# EAGLE design backplane-rev2 (EAGLE 9.6.2)
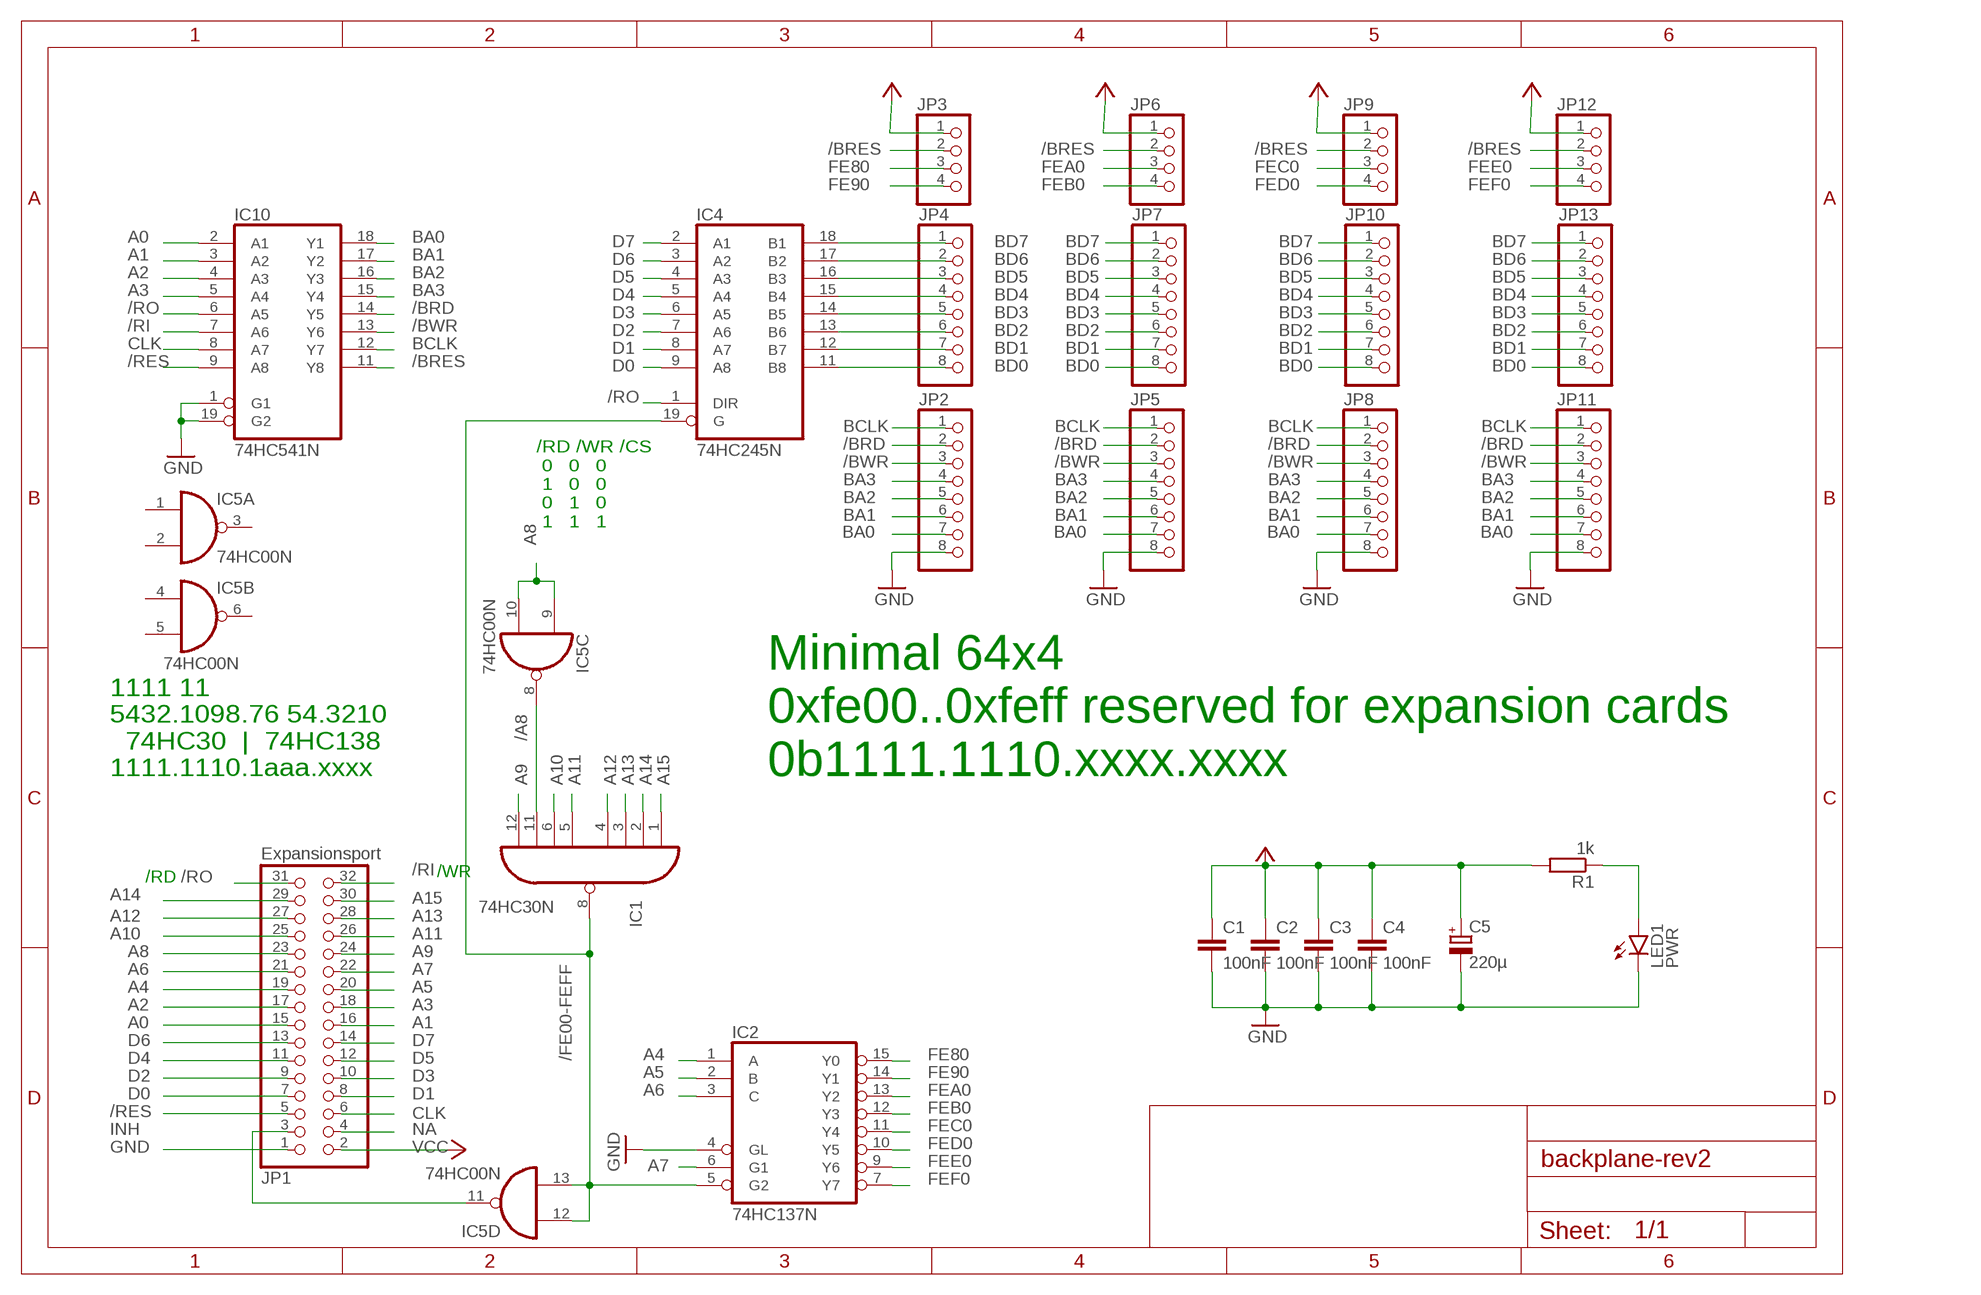
[diagram p0: schematic, sheet 1]

## Parts
C1  100nF  C-EU050-025X075  [C050-025X075]
C2  100nF  C-EU050-025X075  [C050-025X075]
C3  100nF  C-EU050-025X075  [C050-025X075]
C4  100nF  C-EU050-025X075  [C050-025X075]
C5  220µ  CPOL-EUE3.5-8  [E3,5-8]
IC1  74HC30N  [DIL14]
IC2  74HC137N  [DIL16]
IC4  74HC245N  [DIL20]
IC5  74HC00N  [DIL14]
IC10  74HC541N  [DIL20]
JP1  Expansionsport  PINHD-2X16  [2X16]
JP2  PINHD-1X8  [1X08]
JP3  PINHD-1X4  [1X04]
JP4  PINHD-1X8  [1X08]
JP5  PINHD-1X8  [1X08]
JP6  PINHD-1X4  [1X04]
JP7  PINHD-1X8  [1X08]
JP8  PINHD-1X8  [1X08]
JP9  PINHD-1X4  [1X04]
JP10  PINHD-1X8  [1X08]
JP11  PINHD-1X8  [1X08]
JP12  PINHD-1X4  [1X04]
JP13  PINHD-1X8  [1X08]
LED1  PWR  LED3MM  [LED3MM]
R1  1k  R-EU_0207/10  [0207/10]

## Nets
/A8: IC1.11(I6) IC5.8(C:O)
/BRD: IC10.14(Y5) JP2.2 JP5.2 JP8.2 JP11.2
/BRES: IC10.11(Y8) JP3.2 JP6.2 JP9.2 JP12.2
/BWR: IC10.13(Y6) JP2.3 JP5.3 JP8.3 JP11.3
/FE00-FEFF: IC1.8(O) IC2.5(G2) IC4.19(G) IC5.12(D:I0) IC5.13(D:I1)
/RES: IC10.9(A8) JP1.5
/RI: IC10.7(A6) JP1.32
/RO: IC4.1(DIR) IC10.6(A5) JP1.31
A0: IC10.2(A1) JP1.15
A1: IC10.3(A2) JP1.16
A2: IC10.4(A3) JP1.17
A3: IC10.5(A4) JP1.18
A4: IC2.1(A) JP1.19
A5: IC2.2(B) JP1.20
A6: IC2.3(C) JP1.21
A7: IC2.6(G1) JP1.22
A8: IC5.9(C:I0) IC5.10(C:I1) JP1.23
A9: IC1.12(I7) JP1.24
A10: IC1.6(I5) JP1.25
A11: IC1.5(I4) JP1.26
A12: IC1.4(I3) JP1.27
A13: IC1.3(I2) JP1.28
A14: IC1.2(I1) JP1.29
A15: IC1.1(I0) JP1.30
BA0: IC10.18(Y1) JP2.7 JP5.7 JP8.7 JP11.7
BA1: IC10.17(Y2) JP2.6 JP5.6 JP8.6 JP11.6
BA2: IC10.16(Y3) JP2.5 JP5.5 JP8.5 JP11.5
BA3: IC10.15(Y4) JP2.4 JP5.4 JP8.4 JP11.4
BCLK: IC10.12(Y7) JP2.1 JP5.1 JP8.1 JP11.1
BD0: IC4.11(B8) JP4.8 JP7.8 JP10.8 JP13.8
BD1: IC4.12(B7) JP4.7 JP7.7 JP10.7 JP13.7
BD2: IC4.13(B6) JP4.6 JP7.6 JP10.6 JP13.6
BD3: IC4.14(B5) JP4.5 JP7.5 JP10.5 JP13.5
BD4: IC4.15(B4) JP4.4 JP7.4 JP10.4 JP13.4
BD5: IC4.16(B3) JP4.3 JP7.3 JP10.3 JP13.3
BD6: IC4.17(B2) JP4.2 JP7.2 JP10.2 JP13.2
BD7: IC4.18(B1) JP4.1 JP7.1 JP10.1 JP13.1
CLK: IC10.8(A7) JP1.6
D0: IC4.9(A8) JP1.7
D1: IC4.8(A7) JP1.8
D2: IC4.7(A6) JP1.9
D3: IC4.6(A5) JP1.10
D4: IC4.5(A4) JP1.11
D5: IC4.4(A3) JP1.12
D6: IC4.3(A2) JP1.13
D7: IC4.2(A1) JP1.14
FE80: IC2.15(Y0) JP3.3
FE90: IC2.14(Y1) JP3.4
FEA0: IC2.13(Y2) JP6.3
FEB0: IC2.12(Y3) JP6.4
FEC0: IC2.11(Y4) JP9.3
FED0: IC2.10(Y5) JP9.4
FEE0: IC2.9(Y6) JP12.3
FEF0: IC2.7(Y7) JP12.4
GND [Power]: C1.2 C2.2 C3.2 C4.2 C5.- IC2.4(GL) IC10.1(G1) IC10.19(G2) JP1.1 JP2.8 JP5.8 JP8.8 JP11.8 LED1.K(C)
INH: IC5.11(D:O) JP1.3
N$4: LED1.A R1.1
NA: JP1.4
VCC [Power]: C1.1 C2.1 C3.1 C4.1 C5.+ JP1.2 JP3.1 JP6.1 JP9.1 JP12.1 R1.2
Unconnected: IC5.1(A:I0) IC5.2(A:I1) IC5.3(A:O) IC5.4(B:I0) IC5.5(B:I1) IC5.6(B:O)

## Notes on the sheet
- /RD /WR /CS
   0   0   0
   1   0   0
   0   1   0
   1   1   1
- 1111 11
  5432.1098.76 54.3210
    74HC30  |  74HC138
  1111.1110.1aaa.xxxx
- Minimal 64x4
  0xfe00..0xfeff reserved for expansion cards
  0b1111.1110.xxxx.xxxx
- /WR
- /RD

## Power pins joined to a net without a drawn wire
GND: IC1.7(GND) IC2.8(GND) IC4.10(GND) IC5.7(P:GND) IC10.10(GND)
VCC: IC1.14(VCC) IC2.16(VCC) IC4.20(VCC) IC5.14(P:VCC) IC10.20(VCC)

## Library data of the parts
C1-C4 = rcl:C-EU: CAPACITOR, European symbol; SPICEPREFIX: C
C5 = rcl:CPOL-EU: POLARIZED CAPACITOR, European symbol; SPICEPREFIX: C
IC1 = 74xx-eu:74*30: 8-input NAND gate
IC2 = 74xx-eu:74*137: 3-line to 8-line DECODER/DEMULTIPLEXER, address LATCH
IC4 = 74xx-eu:74*245: Octal BUS TRANSCEIVER, 3-state
IC5 = 74xx-eu:74*00: Quad 2-input NAND gate
IC10 = 74xx-eu:74*541: Octal BUFFER and LINE DRIVER, 3-state
JP1 = pinhead:PINHD-2X16: PIN HEADER
JP2 JP4 JP5 JP7 JP8 JP10 JP11 JP13 = pinhead:PINHD-1X8: PIN HEADER
JP3 JP6 JP9 JP12 = pinhead:PINHD-1X4: PIN HEADER
LED1 = led:LED: LED OSRAM: - CHIPLED LG R971, LG N971, LY N971, LG Q971, LY Q971, LO R971, LY R971 LH N974, LH R974 LS Q976, LO Q976, LY Q976 LO Q996 - Hyper CHIPLED LW Q18S LB Q993, LB Q99A, LB R99A - SideLED LS A670, LO A670, LY A670, LG A670, LP A670 LB A673, LV A673, LT A673, LW A673 LH A674 LY A675 LS A676, LA A676, LO A676, LY A676, LW A676 LS A679, LY A679, LG A679 - Hyper Micro SIDELED® LS Y876, LA Y876, LO Y876, LY Y876 LT Y87S - SmartLED LW L88C, LW L88S LB L89C, LB L89S, LG L890 LS L89K, LO L89K, LY L89K LS L896, LA L896, LO L896, LY L896 - TOPLED LS T670, LO T670, LY T670, LG T670, LP T670 LSG T670, LSP T670, LSY T670, LOP T670, LYG T670 LG T671, LOG T671, LSG T671 LB T673, LV T673, LT T673, LW T673 LH T674 LS T676, LA T676, LO T676, LY T676, LB T676, LH T676, LSB T676, LW T676 LB T67C, LV T67C, LT T67C, LS T67K, LO T67K, LY T67K, LW E67C LS E67B, LA E67B, LO E67B, LY E67B, LB E67C, LV E67C, LT E67C LW T67C LS T679, LY T679, LG T679 LS T770, LO T770, LY T770, LG T770, LP T770 LB T773, LV T773, LT T773, LW T773 LH T774 LS E675, LA E675, LY E675, LS T675 LS T776, LA T776, LO T776, LY T776, LB T776 LHGB T686 LT T68C, LB T68C - Hyper Mini TOPLED® LB M676 - Mini TOPLED Santana® LG M470 LS M47K, LO M47K, LY M47K Source: http://www.osram.convergy.de LUXEON: - LUMILED® LXK2-PW12-R00, LXK2-PW12-S00, LXK2-PW14-U00, LXK2-PW14-V00 LXK2-PM12-R00, LXK2-PM12-S00, LXK2-PM14-U00 LXK2-PE12-Q00, LXK2-PE12-R00, LXK2-PE12-S00, LXK2-PE14-T00, LXK2-PE14-U00 LXK2-PB12-K00, LXK2-PB12-L00, LXK2-PB12-M00, LXK2-PB14-N00, LXK2-PB14-P00, LXK2-PB14-Q00 LXK2-PR12-L00, LXK2-PR12-M00, LXK2-PR14-Q00, LXK2-PR14-R00 LXK2-PD12-Q00, LXK2-PD12-R00, LXK2-PD12-S00 LXK2-PH12-R00, LXK2-PH12-S00 LXK2-PL12-P00, LXK2-PL12-Q00, LXK2-PL12-R00 Source: www.luxeon.com KINGBRIGHT: KA-3528ASYC Source: www.kingbright.com
R1 = rcl:R-EU_: RESISTOR, European symbol; SPICEPREFIX: R

## Net classes
0 default: width 0.305 mm, clearance 0.152 mm
1 Power: width 0.457 mm, clearance 0.152 mm

## Board
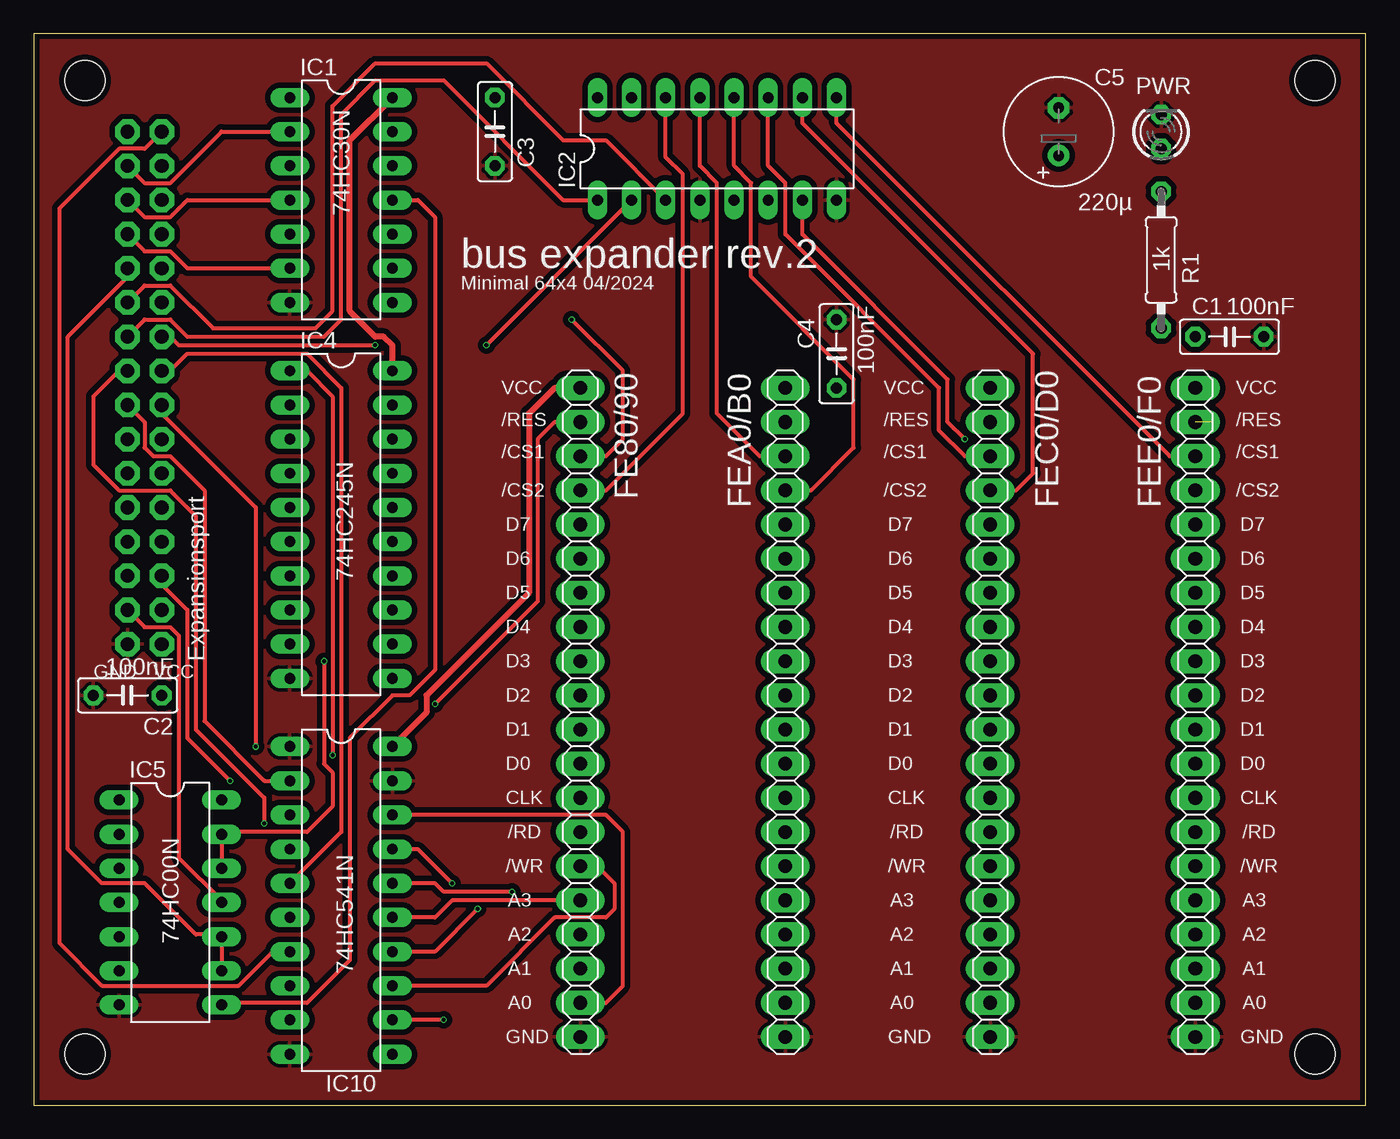
[diagram p1: board, top side]
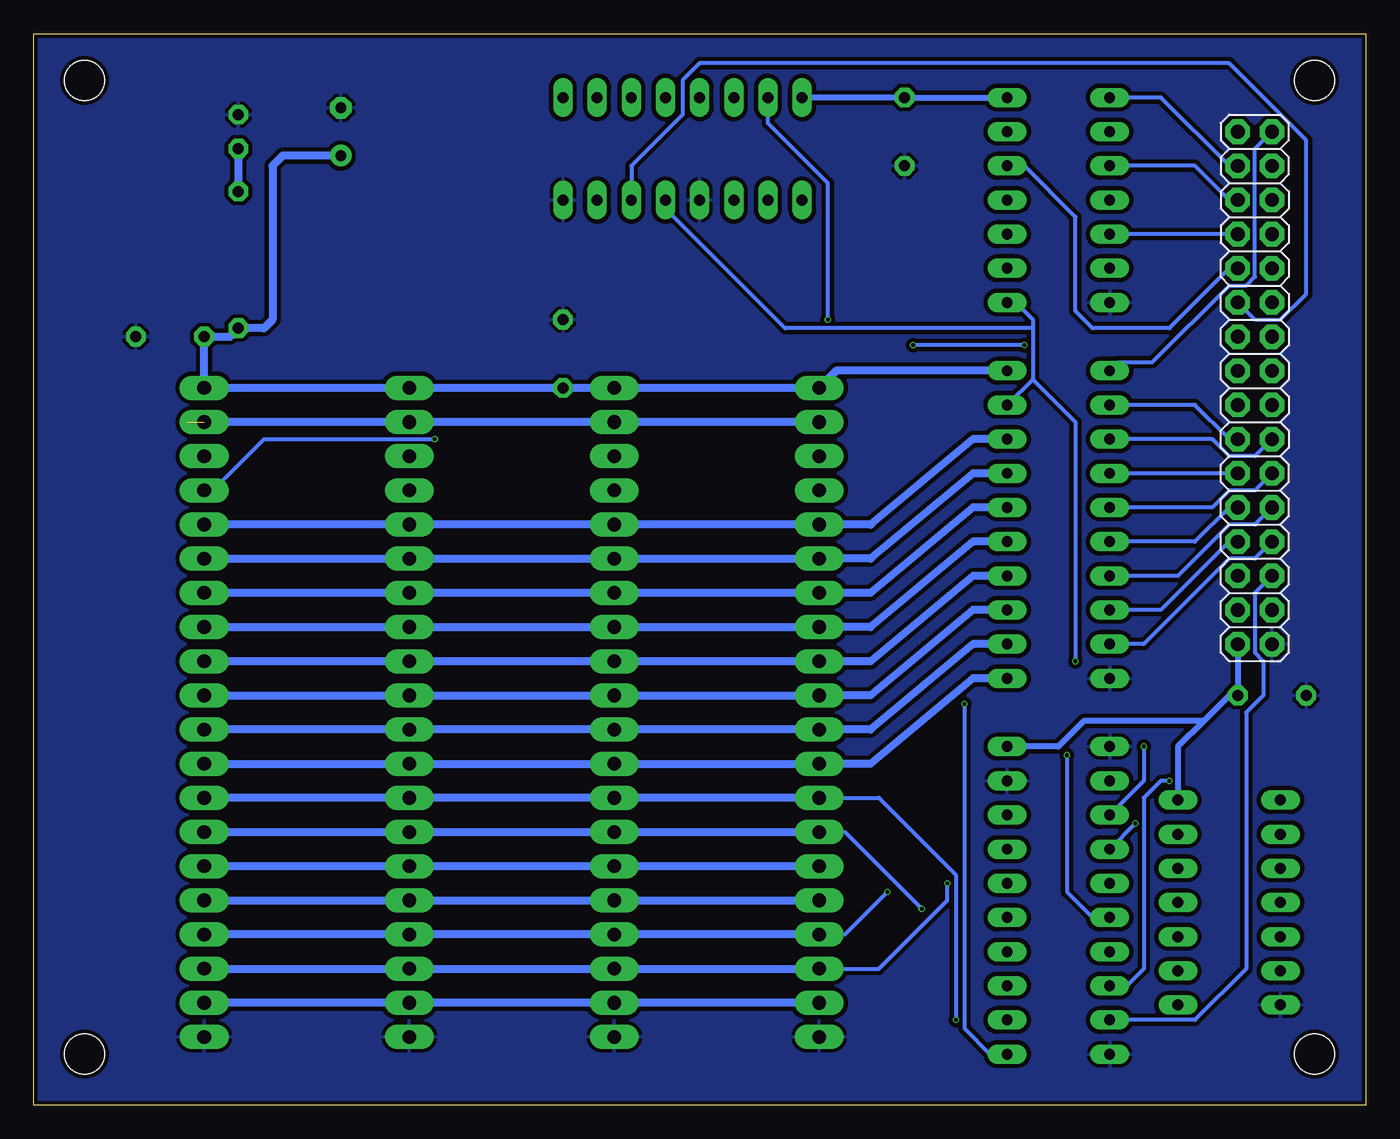
[diagram p2: board, bottom side, seen from below]

Size 99.04 x 79.68 mm. Coordinates in mm from the lower left corner, seen from the top.
Outline: 0,0 99.04,0 99.04,79.68 0,79.68 0,0
Copper layers (1*16): Top 0.035mm / dielectric 1.6mm / Bottom 0.035mm
Design rules "jlcpcb-2layers": minimum track width 5mil, minimum drill 0.3mm, track to track 5mil, track to pad 5mil, pad to pad 5mil, via to via 5mil, smd to smd 5mil, copper to edge 0.2mm, drill to drill 6mil, minimum pad ring 10mil, minimum via ring 3mil, stop-mask expansion 4mil, vias tented up to drill 0mil, thermal gap 10mil
Holes 3 mm at 95.25,76.2 3.81,76.2 3.81,3.81 95.25,3.81

### Footprints (pad centres in the part's own frame; a part is rotated, then mirrored left to right if it is on the bottom)
C050-025X075 = drill 0.813 octagon: 1 -2.54,0; 2 2.54,0
E3,5-8 = drill 0.813 pad 1.6: + -1.778,0 | drill 0.813 pad 1.6 octagon: - 1.778,0
DIL14 = drill 0.813 long: 1 -7.62,-3.81; 2 -5.08,-3.81; 3 -2.54,-3.81; 4 0,-3.81; 5 2.54,-3.81; 6 5.08,-3.81; 7 7.62,-3.81; 8 7.62,3.81; 9 5.08,3.81; 10 2.54,3.81; 11 0,3.81; 12 -2.54,3.81; 13 -5.08,3.81; 14 -7.62,3.81
DIL16 = drill 0.813 long: 1 -8.89,-3.81; 2 -6.35,-3.81; 3 -3.81,-3.81; 4 -1.27,-3.81; 5 1.27,-3.81; 6 3.81,-3.81; 7 6.35,-3.81; 8 8.89,-3.81; 9 8.89,3.81; 10 6.35,3.81; 11 3.81,3.81; 12 1.27,3.81; 13 -1.27,3.81; 14 -3.81,3.81; 15 -6.35,3.81; 16 -8.89,3.81
DIL20 = drill 0.813 long: 1 -11.43,-3.81; 2 -8.89,-3.81; 3 -6.35,-3.81; 4 -3.81,-3.81; 5 -1.27,-3.81; 6 1.27,-3.81; 7 3.81,-3.81; 8 6.35,-3.81; 9 8.89,-3.81; 10 11.43,-3.81; 11 11.43,3.81; 12 8.89,3.81; 13 6.35,3.81; 14 3.81,3.81; 15 1.27,3.81; 16 -1.27,3.81; 17 -3.81,3.81; 18 -6.35,3.81; 19 -8.89,3.81; 20 -11.43,3.81
2X16 = drill 1.016 octagon: 1 -19.05,-1.27; 2 -19.05,1.27; 3 -16.51,-1.27; 4 -16.51,1.27; 5 -13.97,-1.27; 6 -13.97,1.27; 7 -11.43,-1.27; 8 -11.43,1.27; 9 -8.89,-1.27; 10 -8.89,1.27; 11 -6.35,-1.27; 12 -6.35,1.27; 13 -3.81,-1.27; 14 -3.81,1.27; 15 -1.27,-1.27; 16 -1.27,1.27; 17 1.27,-1.27; 18 1.27,1.27; 19 3.81,-1.27; 20 3.81,1.27; 21 6.35,-1.27; 22 6.35,1.27; 23 8.89,-1.27; 24 8.89,1.27; 25 11.43,-1.27; 26 11.43,1.27; 27 13.97,-1.27; 28 13.97,1.27; 29 16.51,-1.27; 30 16.51,1.27; 31 19.05,-1.27; 32 19.05,1.27
1X08 = drill 1.016 long: 1 -8.89,0; 2 -6.35,0; 3 -3.81,0; 4 -1.27,0; 5 1.27,0; 6 3.81,0; 7 6.35,0; 8 8.89,0
1X04 = drill 1.016 long: 1 -3.81,0; 2 -1.27,0; 3 1.27,0; 4 3.81,0
LED3MM = drill 0.813 octagon: A -1.27,0; K 1.27,0
0207/10 = drill 0.813 octagon: 1 -5.08,0; 2 5.08,0

### Placement (x,y rotation side)
C1  88.9,57.15 0 top
C2  6.99,30.48 180 top
C3  34.29,72.39 270 top
C4  59.69,55.88 90 top
C5  76.2,72.39 90 top
IC1  22.86,67.31 270 top
IC2  50.8,71.12 0 top
IC4  22.86,43.18 270 top
IC5  10.16,15.08 270 top
IC10  22.86,15.24 270 top
JP1  8.26,53.34 90 bottom
JP2  40.64,13.97 270 top
JP3  40.64,49.53 270 top
JP4  40.64,34.29 270 top
JP5  55.88,13.97 270 top
JP6  55.88,49.53 270 top
JP7  55.88,34.29 270 top
JP8  71.12,13.97 270 top
JP9  71.12,49.53 270 top
JP10  71.12,34.29 270 top
JP11  86.36,13.97 270 top
JP12  86.36,49.53 270 top
JP13  86.36,34.29 270 top
LED1  83.82,72.39 90 top
R1  83.82,62.87 270 top

### Tracks (layer width: path | path; a pad name or v marks a point on that pad's centre or on a via)
/A8
  Top 0.305: IC1.11 28.57,67.31 29.84,66.04 29.84,32.38 27.94,30.48 26.67,30.48 23.5,27.3 23.5,10.79 20.32,7.62 13.97,7.62 IC5.8
/BRD  (via drill 0.3)
  Top 0.305: IC10.14 29.84,11.43 v33.02,14.61
  Bottom 0.305: v33.02,14.61 38.73,20.32 JP2.2
  Bottom 0.61: JP11.2 JP8.2 JP5.2 JP2.2
/BRES  (via drill 0.3)  (1 unrouted)
  Top 0.305: v29.84,29.84 37.47,37.47 37.47,49.53 38.73,50.8 JP3.2
  Bottom 0.305: IC10.11 27.94,3.81 29.84,5.71 v29.84,29.84
  Bottom 0.61: JP3.2 JP6.2 JP9.2 87.63,50.8
/BWR
  Top 0.305: IC10.13 33.66,8.89 38.73,13.97 42.55,13.97 43.18,14.61 43.18,16.51 41.91,17.78 JP2.3
  Bottom 0.61: JP2.3 JP5.3 JP8.3 JP11.3
/FE00-FEFF  (via drill 0.3)
  Top 0.305: IC5.12 IC5.13 13.97,20.32 20.32,20.32 22.23,22.23 22.23,24.77 21.59,25.4 v21.59,33.02
  Bottom 0.305: 24.77,53.98 IC4.19 | 24.77,57.78 24.77,58.42 26.04,59.69 IC1.8 | 24.77,57.78 24.77,53.98 | IC2.5 52.07,66.67 43.18,57.78 24.77,57.78 | v21.59,33.02 21.59,50.8 24.77,53.98
/RES
  Bottom 0.305: IC10.9 12.7,6.35 8.89,10.16 8.89,29.21 7.62,30.48 7.62,33.02 8.26,33.66 8.26,38.1 JP1.5
/RI
  Top 0.305: IC10.7 17.78,11.43 15.24,8.89 5.08,8.89 1.91,12.06 1.91,66.67 6.35,71.12 8.26,71.12 JP1.32
/RO  (via drill 0.3)
  Top 0.305: v22.23,26.04 22.23,52.7 20.32,54.61 IC4.1
  Bottom 0.305: IC10.6 20.32,13.97 22.23,15.88 v22.23,26.04 | JP1.31 8.26,71.12 8.26,61.59 8.89,60.96 10.16,60.96 15.88,55.24 18.41,55.24 IC4.1
A0
  Top 0.305: IC10.2 17.14,24.13 12.7,28.57 12.7,45.72 10.16,48.26 8.89,48.26 8.26,48.9 8.26,50.8 JP1.15
A1  (via drill 0.3)
  Top 0.305: v16.51,26.67 16.51,44.45 9.53,51.44 JP1.16
  Bottom 0.305: IC10.3 16.51,24.13 v16.51,26.67
A2  (via drill 0.3)
  Top 0.305: v17.14,20.95 17.14,22.86 12.06,27.94 12.06,43.81 10.16,45.72 6.35,45.72 4.45,47.62 4.45,52.7 6.35,54.61 JP1.17
  Bottom 0.305: v17.14,20.95 IC10.4
A3
  Top 0.305: IC10.5 22.86,20.32 22.86,53.34 20.32,55.88 11.43,55.88 10.16,54.61 JP1.18
A4
  Top 0.305: IC2.1 39.37,67.31 30.48,76.2 25.4,76.2 22.86,73.66 22.86,58.42 21.59,57.15 11.43,57.15 10.16,58.42 8.26,58.42 JP1.19
A5  (via drill 0.3)
  Top 0.305: v33.66,56.52 IC2.2 | v25.4,56.52 10.79,56.52 10.16,57.15 JP1.20
  Bottom 0.305: v25.4,56.52 v33.66,56.52
A6
  Top 0.305: IC2.3 42.55,71.75 39.37,71.75 33.66,77.47 25.4,77.47 22.23,74.3 22.23,59.05 20.95,57.78 13.34,57.78 10.16,60.96 8.26,60.96 JP1.21
A7
  Bottom 0.305: IC2.6 54.61,69.85 50.8,73.66 50.8,76.2 49.53,77.47 10.16,77.47 4.45,71.75 4.45,60.33 6.35,58.42 8.26,58.42 JP1.22
A8
  Top 0.305: IC5.9 IC5.10 13.97,12.7 12.06,12.7 8.26,16.51 5.08,16.51 2.54,19.05 2.54,57.15 6.99,61.59 JP1.23
A9
  Bottom 0.305: IC1.12 25.4,69.85 21.59,66.04 21.59,59.05 20.32,57.78 14.61,57.78 10.16,62.23 JP1.24
A10
  Top 0.305: IC1.6 11.43,62.23 10.16,63.5 8.26,63.5 JP1.25
A11
  Bottom 0.305: JP1.26 IC1.5
A12
  Top 0.305: IC1.4 11.43,67.31 10.16,66.04 8.26,66.04 JP1.27
A13
  Bottom 0.305: IC1.3 12.7,69.85 10.16,67.31 JP1.28
A14
  Top 0.305: IC1.2 13.97,72.39 10.16,68.58 8.26,68.58 JP1.29
A15
  Bottom 0.305: IC1.1 15.24,74.93 10.16,69.85 JP1.30
BA0
  Top 0.305: IC10.18 42.55,21.59 43.81,20.32 43.81,8.89 42.55,7.62 JP2.7
  Bottom 0.61: JP2.7 JP5.7 JP8.7 JP11.7
BA1  (via drill 0.3)
  Top 0.305: IC10.17 28.57,19.05 v31.11,16.51
  Bottom 0.305: v31.11,16.51 31.11,15.24 36.2,10.16 JP2.6
  Bottom 0.61: JP11.6 JP8.6 JP5.6 JP2.6
BA2  (via drill 0.3)
  Top 0.305: IC10.16 29.84,16.51 30.48,15.88 v35.56,15.88
  Bottom 0.305: v35.56,15.88 38.73,12.7 JP2.5
  Bottom 0.61: JP2.5 JP5.5 JP8.5 JP11.5
BA3
  Top 0.305: IC10.15 29.84,13.97 31.11,15.24 JP2.4
  Bottom 0.61: JP11.4 JP8.4 JP5.4 JP2.4
BCLK  (via drill 0.3)
  Top 0.305: v30.48,6.35 IC10.12
  Bottom 0.305: v30.48,6.35 30.48,17.14 36.2,22.86 JP2.1
  Bottom 0.61: JP2.1 JP5.1 JP8.1 JP11.1
BD0
  Bottom 0.61: JP13.8 JP10.8 JP7.8 JP4.8 36.83,25.4 29.21,31.75 IC4.11
BD1
  Bottom 0.61: JP13.7 JP10.7 JP7.7 JP4.7 36.83,27.94 29.21,34.29 IC4.12
BD2
  Bottom 0.61: JP13.6 JP10.6 JP7.6 JP4.6 36.83,30.48 29.21,36.83 IC4.13
BD3
  Bottom 0.61: JP13.5 JP10.5 JP7.5 JP4.5 36.83,33.02 29.21,39.37 IC4.14
BD4
  Bottom 0.61: JP13.4 JP10.4 JP7.4 JP4.4 36.83,35.56 29.21,41.91 IC4.15
BD5
  Bottom 0.61: JP13.3 JP10.3 JP7.3 JP4.3 36.83,38.1 29.21,44.45 IC4.16
BD6
  Bottom 0.61: JP13.2 JP10.2 JP7.2 JP4.2 36.83,40.64 29.21,46.99 IC4.17
BD7
  Bottom 0.61: JP13.1 JP10.1 JP7.1 JP4.1 36.83,43.18 29.21,49.53 IC4.18
CLK  (via drill 0.3)
  Top 0.305: v14.61,24.13 11.43,27.3 11.43,36.83 9.53,38.73 JP1.6
  Bottom 0.305: IC10.8 17.78,8.89 16.51,10.16 16.51,22.86 15.24,24.13 v14.61,24.13
D0
  Bottom 0.305: IC4.9 16.51,34.29 10.16,40.64 8.26,40.64 JP1.7
D1
  Bottom 0.305: IC4.8 15.24,36.83 10.16,41.91 JP1.8
D2
  Bottom 0.305: IC4.7 13.97,39.37 10.16,43.18 8.26,43.18 JP1.9
D3
  Bottom 0.305: IC4.6 12.7,41.91 10.16,44.45 JP1.10
D4
  Bottom 0.305: IC4.5 11.43,44.45 10.16,45.72 8.26,45.72 JP1.11
D5
  Bottom 0.305: JP1.12 IC4.4
D6
  Bottom 0.305: IC4.3 11.43,49.53 10.16,48.26 8.26,48.26 JP1.13
D7
  Bottom 0.305: IC4.2 12.7,52.07 10.16,49.53 JP1.14
FE80  (via drill 0.3)
  Top 0.305: v40.01,58.42 43.81,54.61 43.81,49.53 42.55,48.26 JP3.3
  Bottom 0.305: IC2.15 44.45,73.03 40.01,68.58 v40.01,58.42
FE90
  Top 0.305: IC2.14 46.99,70.48 48.26,69.22 48.26,51.44 42.55,45.72 JP3.4
FEA0
  Top 0.305: IC2.13 49.53,69.85 50.8,68.58 50.8,51.44 53.98,48.26 JP6.3
FEB0
  Top 0.305: IC2.12 52.07,69.85 53.34,68.58 53.34,61.59 60.96,53.98 60.96,48.9 57.78,45.72 JP6.4
FEC0
  Top 0.305: IC2.11 54.61,69.85 55.88,68.58 55.88,64.77 67.31,53.34 67.31,50.16 69.22,48.26 JP9.3
FED0
  Top 0.305: IC2.10 57.15,73.03 74.3,55.88 74.3,46.99 73.03,45.72 JP9.4
FEE0
  Top 0.305: IC2.9 59.69,73.03 84.45,48.26 JP12.3
FEF0  (via drill 0.3)
  Top 0.305: IC2.7 57.15,64.77 67.94,53.98 67.94,50.8 v69.22,49.53
  Bottom 0.305: v69.22,49.53 81.92,49.53 85.72,45.72 JP12.4
GND
  pour Bottom (isolate 0.305): 0,79.38 0,0 99.06,0 99.06,79.38 98.42,80.01 0.64,80.01
  pour Top (isolate 0.406): 0,79.38 0,0 99.06,0 99.06,79.38
INH
  Top 0.305: JP1.3 8.26,35.56 10.16,35.56 10.79,34.92 10.79,18.41 13.97,15.24 IC5.11
N$4
  Bottom 0.61: LED1.A R1.1
VCC
  Top 0.457: IC1.14 23.5,71.75 23.5,59.05 25.4,57.15 26.04,57.15 26.67,56.52 IC4.20 | IC10.20 29.21,29.21 29.21,30.48 36.83,38.1 36.83,51.44 38.73,53.34 JP3.1
  Bottom 0.457: JP1.2 9.53,31.11 | IC5.14 13.97,26.67 12.06,28.57 | 9.53,31.11 12.06,28.57 | 9.53,31.11 C2.1 | IC10.20 22.86,26.67 20.95,28.57 12.06,28.57 | IC1.14 C3.1 IC2.16
  Bottom 0.61: C5.+ 80.52,70.61 81.28,69.85 81.28,58.42 81.92,57.78 R1.2 84.45,57.15 C1.1 JP12.1 JP9.1 C4.1 JP6.1 JP3.1 39.37,54.61 IC4.20

### Text on the board
tPlace: bus expander rev.2 | Minimal 64x4 04/2024 | VCC | VCC | VCC | /RES | /RES | /RES | /CS1 | /CS1 | /CS1 | /CS2 | FE80/90 | /CS2 | /CS2 | FEA0/B0 | FEC0/D0 | FEE0/F0 | D7 | D7 | D7 | D6 | D6 | D6 | D5 | D5 | D5 | D4 | D4 | D4 | D3 | D3 | D3 | GND | VCC | D2 | D2 | D2 | D1 | D1 | D1 | D0 | D0 | D0 | CLK | CLK | CLK | /RD | /RD | /RD | /WR | /WR | /WR | A3 | A3 | A3 | A2 | A2 | A2 | A1 | A1 | A1 | A0 | A0 | A0 | GND | GND | GND